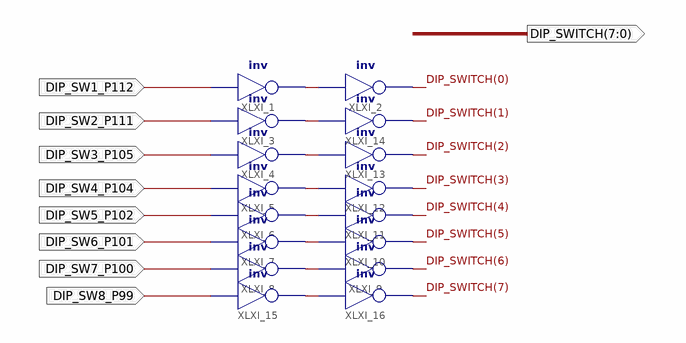
[diagram p0: schematic sheet 1]
// Xilinx ISE schematic DIP_switch.sch (spartan6) as structural Verilog: 16 symbols, 9 ports
module DIP_switch (
  input  DIP_SW1_P112,
  input  DIP_SW2_P111,
  input  DIP_SW3_P105,
  input  DIP_SW4_P104,
  input  DIP_SW5_P102,
  input  DIP_SW6_P101,
  input  DIP_SW7_P100,
  input  DIP_SW8_P99,
  output [7:0] DIP_SWITCH
);

  wire XLXN_11, XLXN_12, XLXN_13, XLXN_14, XLXN_15, XLXN_16, XLXN_17, XLXN_25;

  not XLXI_1 (XLXN_11, DIP_SW1_P112);
  not XLXI_2 (DIP_SWITCH[0], XLXN_11);
  not XLXI_3 (XLXN_17, DIP_SW2_P111);
  not XLXI_4 (XLXN_16, DIP_SW3_P105);
  not XLXI_5 (XLXN_15, DIP_SW4_P104);
  not XLXI_6 (XLXN_14, DIP_SW5_P102);
  not XLXI_7 (XLXN_13, DIP_SW6_P101);
  not XLXI_8 (XLXN_12, DIP_SW7_P100);
  not XLXI_9 (DIP_SWITCH[6], XLXN_12);
  not XLXI_10 (DIP_SWITCH[5], XLXN_13);
  not XLXI_11 (DIP_SWITCH[4], XLXN_14);
  not XLXI_12 (DIP_SWITCH[3], XLXN_15);
  not XLXI_13 (DIP_SWITCH[2], XLXN_16);
  not XLXI_14 (DIP_SWITCH[1], XLXN_17);
  not XLXI_15 (XLXN_25, DIP_SW8_P99);
  not XLXI_16 (DIP_SWITCH[7], XLXN_25);
endmodule
